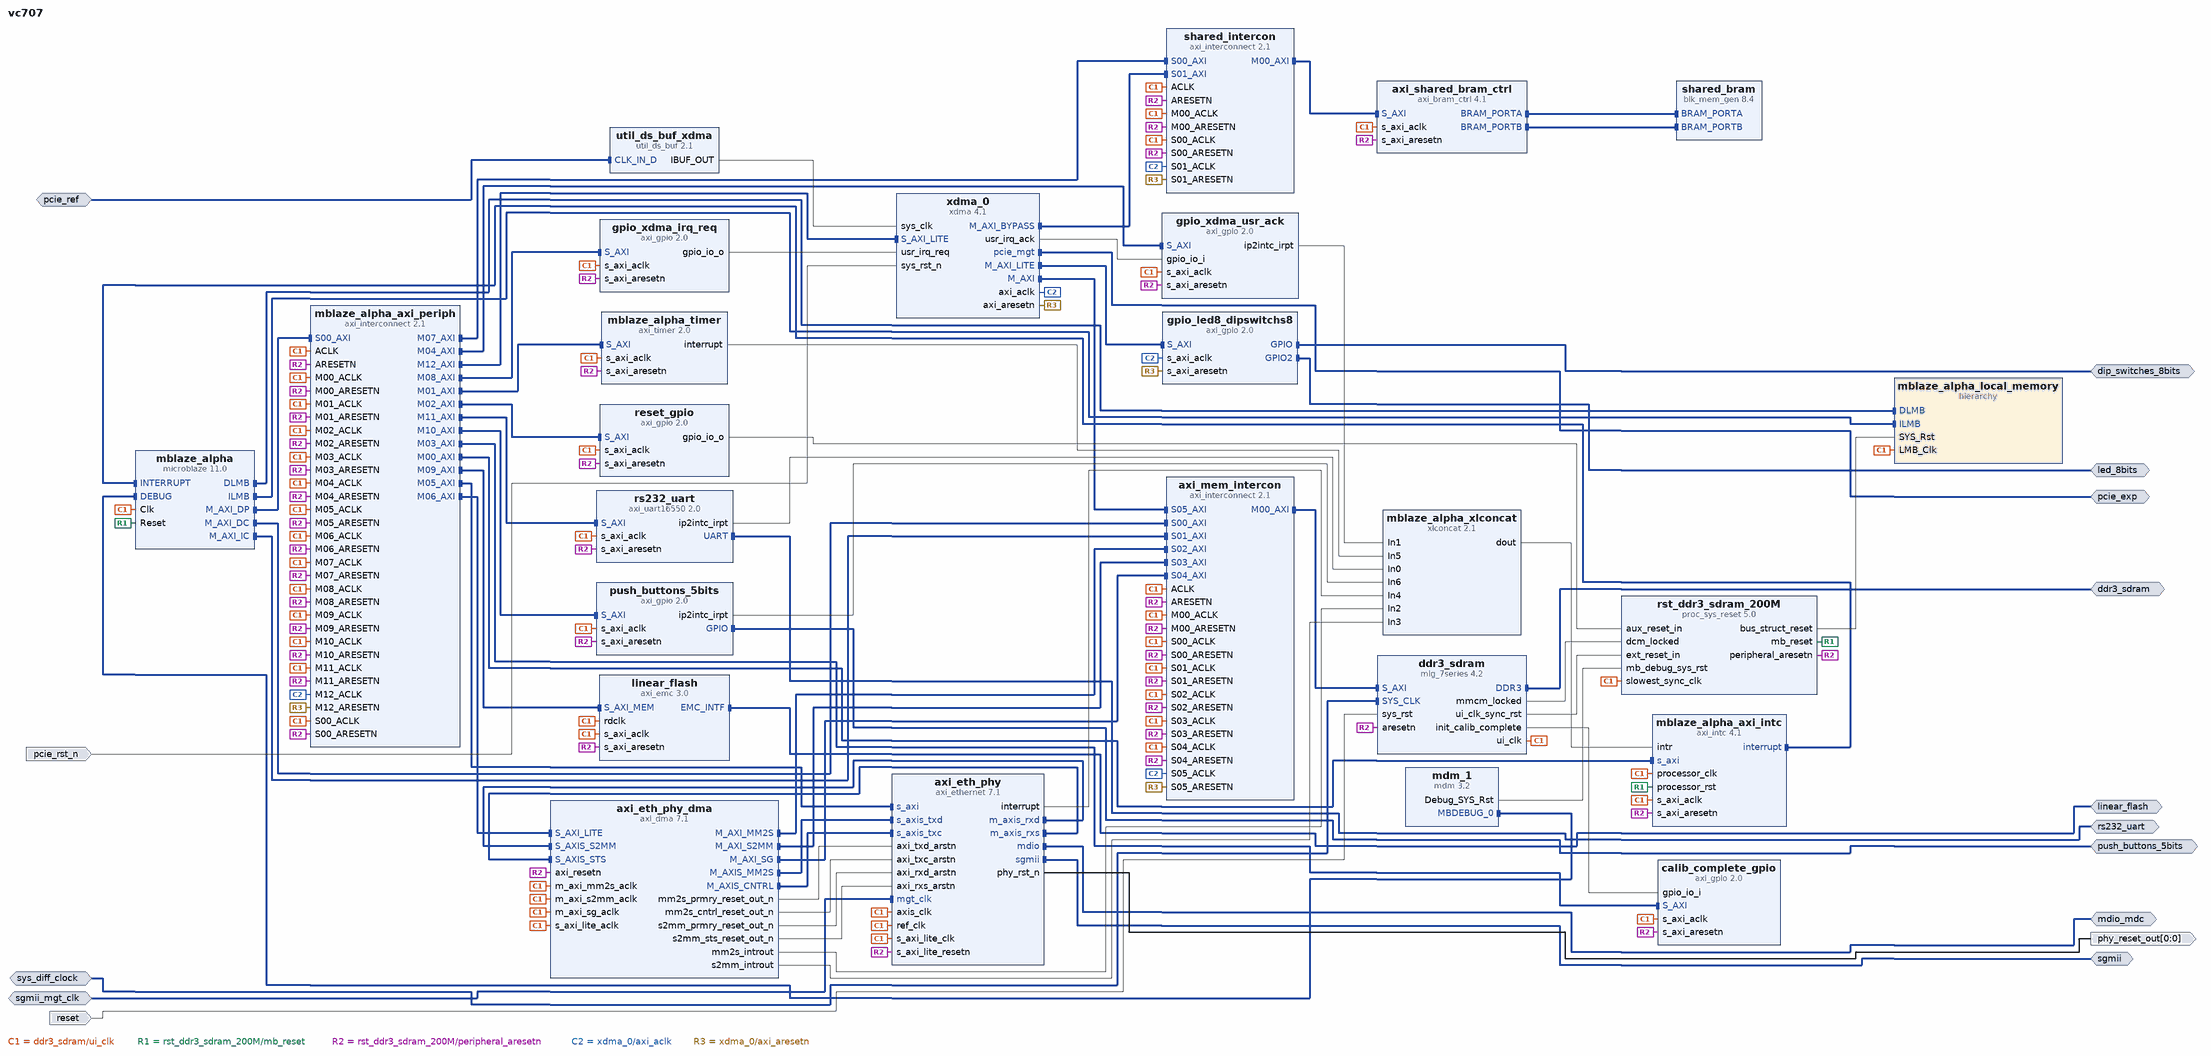
[diagram p0: block diagram of the top level]
# Vivado block design vc707, xc7vx485tffg1761-2, Vivado 2019.2
create_bd_design vc707

create_bd_intf_port -mode Master -vlnv xilinx.com:interface:gpio_rtl:1.0 push_buttons_5bits
create_bd_intf_port -mode Master -vlnv xilinx.com:interface:emc_rtl:1.0 linear_flash
create_bd_intf_port -mode Master -vlnv xilinx.com:interface:gpio_rtl:1.0 dip_switches_8bits
create_bd_intf_port -mode Master -vlnv xilinx.com:interface:ddrx_rtl:1.0 ddr3_sdram
create_bd_intf_port -mode Master -vlnv xilinx.com:interface:uart_rtl:1.0 rs232_uart
create_bd_intf_port -mode Master -vlnv xilinx.com:interface:pcie_7x_mgt_rtl:1.0 pcie_exp
create_bd_intf_port -mode Master -vlnv xilinx.com:interface:gpio_rtl:1.0 led_8bits
create_bd_intf_port -mode Slave -vlnv xilinx.com:interface:diff_clock_rtl:1.0 pcie_ref
create_bd_intf_port -mode Slave -vlnv xilinx.com:interface:diff_clock_rtl:1.0 sys_diff_clock
set_property -dict {CONFIG.FREQ_HZ 200000000} [get_bd_intf_ports sys_diff_clock]
create_bd_intf_port -mode Master -vlnv xilinx.com:interface:sgmii_rtl:1.0 sgmii
create_bd_intf_port -mode Master -vlnv xilinx.com:interface:mdio_rtl:1.0 mdio_mdc
create_bd_intf_port -mode Slave -vlnv xilinx.com:interface:diff_clock_rtl:1.0 sgmii_mgt_clk
set_property -dict {CONFIG.FREQ_HZ 125000000} [get_bd_intf_ports sgmii_mgt_clk]
create_bd_port -dir I -type rst reset
set_property -dict {CONFIG.POLARITY ACTIVE_HIGH} [get_bd_ports reset]
create_bd_port -dir I -type rst pcie_rst_n
create_bd_port -dir O -from 0 -to 0 -type rst phy_reset_out

create_bd_cell -type hier mblaze_alpha_local_memory
create_bd_cell -type ip -vlnv xilinx.com:ip:axi_interconnect:2.1 axi_mem_intercon
set_property -dict {CONFIG.NUM_MI 1 CONFIG.NUM_SI 6} [get_bd_cells axi_mem_intercon]
create_bd_cell -type ip -vlnv xilinx.com:ip:axi_timer:2.0 mblaze_alpha_timer
set_property -dict {CONFIG.enable_timer2 1} [get_bd_cells mblaze_alpha_timer]
create_bd_cell -type ip -vlnv xilinx.com:ip:axi_gpio:2.0 calib_complete_gpio
set_property -dict {CONFIG.C_ALL_INPUTS 1 CONFIG.C_GPIO_WIDTH 1 CONFIG.C_IS_DUAL 0} [get_bd_cells calib_complete_gpio]
create_bd_cell -type ip -vlnv xilinx.com:ip:mig_7series:4.2 ddr3_sdram
set_property -dict [list \
  CONFIG.BOARD_MIG_PARAM ddr3_sdram \
  CONFIG.RESET_BOARD_INTERFACE reset \
  CONFIG.XML_INPUT_FILE board.prj \
] [get_bd_cells ddr3_sdram]
create_bd_cell -type ip -vlnv xilinx.com:ip:axi_gpio:2.0 gpio_led8_dipswitchs8
set_property -dict [list \
  CONFIG.GPIO2_BOARD_INTERFACE led_8bits \
  CONFIG.GPIO_BOARD_INTERFACE dip_switches_8bits \
  CONFIG.USE_BOARD_FLOW true \
] [get_bd_cells gpio_led8_dipswitchs8]
create_bd_cell -type ip -vlnv xilinx.com:ip:axi_emc:3.0 linear_flash
set_property -dict [list \
  CONFIG.C_INCLUDE_DATAWIDTH_MATCHING_0 1 \
  CONFIG.C_MEM0_TYPE 2 \
  CONFIG.C_MEM0_WIDTH 16 \
  CONFIG.C_TAVDV_PS_MEM_0 96000 \
  CONFIG.C_TCEDV_PS_MEM_0 96000 \
  CONFIG.C_THZCE_PS_MEM_0 9000 \
  CONFIG.C_TLZWE_PS_MEM_0 20000 \
  CONFIG.C_TWC_PS_MEM_0 40000 \
  CONFIG.C_TWPH_PS_MEM_0 20000 \
  CONFIG.C_TWP_PS_MEM_0 40000 \
  CONFIG.C_WR_REC_TIME_MEM_0 200000 \
  CONFIG.EMC_BOARD_INTERFACE linear_flash \
  CONFIG.USE_BOARD_FLOW true \
] [get_bd_cells linear_flash]
create_bd_cell -type ip -vlnv xilinx.com:ip:mdm:3.2 mdm_1
create_bd_cell -type ip -vlnv xilinx.com:ip:microblaze:11.0 mblaze_alpha
set_property -dict [list \
  CONFIG.C_ADDR_TAG_BITS 16 \
  CONFIG.C_CACHE_BYTE_SIZE 16384 \
  CONFIG.C_DCACHE_ADDR_TAG 16 \
  CONFIG.C_DCACHE_BYTE_SIZE 16384 \
  CONFIG.C_DCACHE_LINE_LEN 8 \
  CONFIG.C_DCACHE_USE_WRITEBACK 0 \
  CONFIG.C_DEBUG_ENABLED 1 \
  CONFIG.C_DIV_ZERO_EXCEPTION 1 \
  CONFIG.C_D_AXI 1 \
  CONFIG.C_D_LMB 1 \
  CONFIG.C_ICACHE_FORCE_TAG_LUTRAM 1 \
  CONFIG.C_ICACHE_LINE_LEN 8 \
  CONFIG.C_ICACHE_STREAMS 1 \
  CONFIG.C_ICACHE_VICTIMS 8 \
  CONFIG.C_ILL_OPCODE_EXCEPTION 1 \
  CONFIG.C_I_LMB 1 \
  CONFIG.C_MMU_ZONES 2 \
  CONFIG.C_M_AXI_D_BUS_EXCEPTION 1 \
  CONFIG.C_M_AXI_I_BUS_EXCEPTION 1 \
  CONFIG.C_OPCODE_0x0_ILLEGAL 1 \
  CONFIG.C_PVR 2 \
  CONFIG.C_UNALIGNED_EXCEPTIONS 1 \
  CONFIG.C_USE_BARREL 1 \
  CONFIG.C_USE_BRANCH_TARGET_CACHE 0 \
  CONFIG.C_USE_DCACHE 1 \
  CONFIG.C_USE_DIV 1 \
  CONFIG.C_USE_FPU 0 \
  CONFIG.C_USE_HW_MUL 2 \
  CONFIG.C_USE_ICACHE 1 \
  CONFIG.C_USE_MMU 3 \
  CONFIG.C_USE_MSR_INSTR 1 \
  CONFIG.C_USE_PCMP_INSTR 1 \
  CONFIG.G_TEMPLATE_LIST 4 \
  CONFIG.G_USE_EXCEPTIONS 1 \
] [get_bd_cells mblaze_alpha]
create_bd_cell -type ip -vlnv xilinx.com:ip:axi_intc:4.1 mblaze_alpha_axi_intc
set_property -dict {CONFIG.C_HAS_FAST 1} [get_bd_cells mblaze_alpha_axi_intc]
create_bd_cell -type ip -vlnv xilinx.com:ip:axi_interconnect:2.1 mblaze_alpha_axi_periph
set_property -dict {CONFIG.NUM_MI 13 CONFIG.NUM_SI 1} [get_bd_cells mblaze_alpha_axi_periph]
create_bd_cell -type ip -vlnv xilinx.com:ip:xlconcat:2.1 mblaze_alpha_xlconcat
set_property -dict {CONFIG.NUM_PORTS 7 CONFIG.dout_width 7} [get_bd_cells mblaze_alpha_xlconcat]
create_bd_cell -type ip -vlnv xilinx.com:ip:axi_gpio:2.0 push_buttons_5bits
set_property -dict [list \
  CONFIG.C_INTERRUPT_PRESENT 1 \
  CONFIG.GPIO_BOARD_INTERFACE push_buttons_5bits \
  CONFIG.USE_BOARD_FLOW true \
] [get_bd_cells push_buttons_5bits]
create_bd_cell -type ip -vlnv xilinx.com:ip:axi_gpio:2.0 reset_gpio
set_property -dict {CONFIG.C_ALL_OUTPUTS 1 CONFIG.C_GPIO_WIDTH 1} [get_bd_cells reset_gpio]
create_bd_cell -type ip -vlnv xilinx.com:ip:axi_uart16550:2.0 rs232_uart
set_property -dict [list \
  CONFIG.C_S_AXI_ACLK_FREQ_HZ 200000000 \
  CONFIG.UART_BOARD_INTERFACE rs232_uart \
  CONFIG.USE_BOARD_FLOW true \
] [get_bd_cells rs232_uart]
create_bd_cell -type ip -vlnv xilinx.com:ip:proc_sys_reset:5.0 rst_ddr3_sdram_200M
set_property -dict {CONFIG.C_AUX_RESET_HIGH 1 CONFIG.C_AUX_RST_WIDTH 1} [get_bd_cells rst_ddr3_sdram_200M]
create_bd_cell -type ip -vlnv xilinx.com:ip:xdma:4.1 xdma_0
set_property -dict [list \
  CONFIG.PF0_DEVICE_ID_mqdma 9028 \
  CONFIG.PF2_DEVICE_ID_mqdma 9028 \
  CONFIG.PF3_DEVICE_ID_mqdma 9028 \
  CONFIG.axi_data_width 128_bit \
  CONFIG.axilite_master_en true \
  CONFIG.axilite_master_scale Kilobytes \
  CONFIG.axilite_master_size 128 \
  CONFIG.axist_bypass_en true \
  CONFIG.axist_bypass_scale Kilobytes \
  CONFIG.axist_bypass_size 64 \
  CONFIG.axisten_freq 250 \
  CONFIG.cfg_mgmt_if false \
  CONFIG.pcie_blk_locn X1Y1 \
  CONFIG.pf0_device_id 7029 \
  CONFIG.pf0_interrupt_pin INTA \
  CONFIG.pf0_msi_cap_multimsgcap 1_vector \
  CONFIG.pf0_msi_enabled true \
  CONFIG.pf0_msix_enabled false \
  CONFIG.pl_link_cap_max_link_speed 5.0_GT/s \
  CONFIG.pl_link_cap_max_link_width X8 \
  CONFIG.plltype QPLL1 \
  CONFIG.xdma_axilite_slave true \
  CONFIG.xdma_num_usr_irq 1 \
] [get_bd_cells xdma_0]
create_bd_cell -type ip -vlnv xilinx.com:ip:util_ds_buf:2.1 util_ds_buf_xdma
set_property -dict {CONFIG.C_BUF_TYPE IBUFDSGTE} [get_bd_cells util_ds_buf_xdma]
create_bd_cell -type ip -vlnv xilinx.com:ip:axi_gpio:2.0 gpio_xdma_irq_req
set_property -dict {CONFIG.C_ALL_OUTPUTS 1 CONFIG.C_GPIO_WIDTH 1} [get_bd_cells gpio_xdma_irq_req]
create_bd_cell -type ip -vlnv xilinx.com:ip:axi_gpio:2.0 gpio_xdma_usr_ack
set_property -dict {CONFIG.C_ALL_INPUTS 1 CONFIG.C_GPIO_WIDTH 1 CONFIG.C_INTERRUPT_PRESENT 1} [get_bd_cells gpio_xdma_usr_ack]
create_bd_cell -type ip -vlnv xilinx.com:ip:axi_interconnect:2.1 shared_intercon
set_property -dict {CONFIG.NUM_MI 1 CONFIG.NUM_SI 2} [get_bd_cells shared_intercon]
create_bd_cell -type ip -vlnv xilinx.com:ip:axi_bram_ctrl:4.1 axi_shared_bram_ctrl
create_bd_cell -type ip -vlnv xilinx.com:ip:blk_mem_gen:8.4 shared_bram
set_property -dict {CONFIG.Memory_Type True_Dual_Port_RAM} [get_bd_cells shared_bram]
create_bd_cell -type ip -vlnv xilinx.com:ip:axi_ethernet:7.1 axi_eth_phy
set_property -dict [list \
  CONFIG.DIFFCLK_BOARD_INTERFACE sgmii_mgt_clk \
  CONFIG.ETHERNET_BOARD_INTERFACE sgmii \
  CONFIG.MDIO_BOARD_INTERFACE mdio_mdc \
  CONFIG.PHYRST_BOARD_INTERFACE phy_reset_out \
] [get_bd_cells axi_eth_phy]
create_bd_cell -type ip -vlnv xilinx.com:ip:axi_dma:7.1 axi_eth_phy_dma
set_property -dict [list \
  CONFIG.c_include_mm2s_dre 1 \
  CONFIG.c_include_s2mm_dre 1 \
  CONFIG.c_sg_length_width 16 \
  CONFIG.c_sg_use_stsapp_length 1 \
] [get_bd_cells axi_eth_phy_dma]

# ---- hierarchy /mblaze_alpha_local_memory ----
current_bd_instance /mblaze_alpha_local_memory
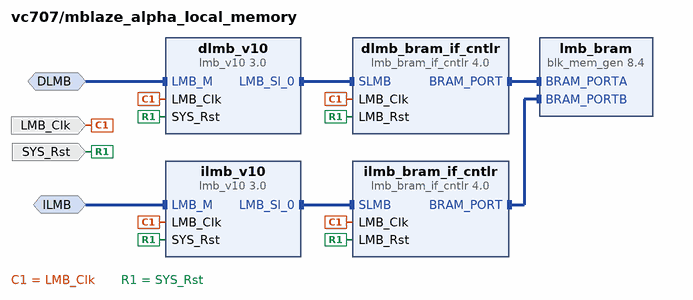
[diagram p1: block diagram inside /mblaze_alpha_local_memory]
create_bd_intf_pin -mode MirroredMaster -vlnv xilinx.com:interface:lmb_rtl:1.0 DLMB
create_bd_intf_pin -mode MirroredMaster -vlnv xilinx.com:interface:lmb_rtl:1.0 ILMB
create_bd_pin -dir I -type clk LMB_Clk
create_bd_pin -dir I -type rst SYS_Rst

create_bd_cell -type ip -vlnv xilinx.com:ip:lmb_bram_if_cntlr:4.0 dlmb_bram_if_cntlr
set_property -dict {CONFIG.C_ECC 0} [get_bd_cells dlmb_bram_if_cntlr]
create_bd_cell -type ip -vlnv xilinx.com:ip:lmb_v10:3.0 dlmb_v10
create_bd_cell -type ip -vlnv xilinx.com:ip:lmb_bram_if_cntlr:4.0 ilmb_bram_if_cntlr
set_property -dict {CONFIG.C_ECC 0} [get_bd_cells ilmb_bram_if_cntlr]
create_bd_cell -type ip -vlnv xilinx.com:ip:lmb_v10:3.0 ilmb_v10
create_bd_cell -type ip -vlnv xilinx.com:ip:blk_mem_gen:8.4 lmb_bram
set_property -dict [list \
  CONFIG.Enable_B Use_ENB_Pin \
  CONFIG.Memory_Type True_Dual_Port_RAM \
  CONFIG.Port_B_Clock 100 \
  CONFIG.Port_B_Enable_Rate 100 \
  CONFIG.Port_B_Write_Rate 50 \
  CONFIG.Use_RSTB_Pin true \
  CONFIG.use_bram_block BRAM_Controller \
] [get_bd_cells lmb_bram]

# ---- connections ----

current_bd_instance /mblaze_alpha_local_memory
connect_bd_intf_net -intf_net microblaze_0_ilmb_bus [get_bd_intf_pins ilmb_v10/LMB_Sl_0] [get_bd_intf_pins ilmb_bram_if_cntlr/SLMB]
connect_bd_intf_net -intf_net microblaze_0_dlmb_cntlr [get_bd_intf_pins dlmb_bram_if_cntlr/BRAM_PORT] [get_bd_intf_pins lmb_bram/BRAM_PORTA]
connect_bd_intf_net -intf_net microblaze_0_dlmb [get_bd_intf_pins DLMB] [get_bd_intf_pins dlmb_v10/LMB_M]
connect_bd_intf_net -intf_net microblaze_0_ilmb_cntlr [get_bd_intf_pins ilmb_bram_if_cntlr/BRAM_PORT] [get_bd_intf_pins lmb_bram/BRAM_PORTB]
connect_bd_intf_net -intf_net microblaze_0_ilmb [get_bd_intf_pins ILMB] [get_bd_intf_pins ilmb_v10/LMB_M]
connect_bd_intf_net -intf_net microblaze_0_dlmb_bus [get_bd_intf_pins dlmb_v10/LMB_Sl_0] [get_bd_intf_pins dlmb_bram_if_cntlr/SLMB]
connect_bd_net -net microblaze_0_Clk [get_bd_pins LMB_Clk] \
  [get_bd_pins dlmb_bram_if_cntlr/LMB_Clk] [get_bd_pins dlmb_v10/LMB_Clk] [get_bd_pins ilmb_bram_if_cntlr/LMB_Clk] \
  [get_bd_pins ilmb_v10/LMB_Clk]
connect_bd_net [get_bd_pins SYS_Rst] \
  [get_bd_pins dlmb_bram_if_cntlr/LMB_Rst] [get_bd_pins dlmb_v10/SYS_Rst] [get_bd_pins ilmb_bram_if_cntlr/LMB_Rst] \
  [get_bd_pins ilmb_v10/SYS_Rst]
set_property HDL_ATTRIBUTE.BMM_INFO_ADDRESS_SPACE {byte  0x40000000 32 > vc707 mblaze_alpha_local_memory/lmb_bram} [get_bd_cells dlmb_bram_if_cntlr]
set_property HDL_ATTRIBUTE.KEEP_HIERARCHY yes [get_bd_cells dlmb_bram_if_cntlr]

current_bd_instance /
connect_bd_intf_net [get_bd_intf_pins shared_intercon/M00_AXI] [get_bd_intf_pins axi_shared_bram_ctrl/S_AXI]
connect_bd_intf_net [get_bd_intf_ports sys_diff_clock] [get_bd_intf_pins ddr3_sdram/SYS_CLK]
connect_bd_intf_net [get_bd_intf_pins mblaze_alpha_axi_periph/M04_AXI] [get_bd_intf_pins gpio_xdma_usr_ack/S_AXI]
connect_bd_intf_net [get_bd_intf_ports rs232_uart] [get_bd_intf_pins rs232_uart/UART]
connect_bd_intf_net [get_bd_intf_ports ddr3_sdram] [get_bd_intf_pins ddr3_sdram/DDR3]
connect_bd_intf_net -intf_net microblaze_0_dlmb_1 [get_bd_intf_pins mblaze_alpha/DLMB] [get_bd_intf_pins mblaze_alpha_local_memory/DLMB]
connect_bd_intf_net [get_bd_intf_pins mblaze_alpha_axi_periph/M03_AXI] [get_bd_intf_pins calib_complete_gpio/S_AXI]
connect_bd_intf_net -intf_net microblaze_0_ilmb_1 [get_bd_intf_pins mblaze_alpha/ILMB] [get_bd_intf_pins mblaze_alpha_local_memory/ILMB]
connect_bd_intf_net [get_bd_intf_pins xdma_0/M_AXI_BYPASS] [get_bd_intf_pins shared_intercon/S01_AXI]
connect_bd_intf_net -intf_net microblaze_0_interrupt [get_bd_intf_pins mblaze_alpha_axi_intc/interrupt] [get_bd_intf_pins mblaze_alpha/INTERRUPT]
connect_bd_intf_net [get_bd_intf_pins mblaze_alpha_axi_periph/M12_AXI] [get_bd_intf_pins xdma_0/S_AXI_LITE]
connect_bd_intf_net [get_bd_intf_ports linear_flash] [get_bd_intf_pins linear_flash/EMC_INTF]
connect_bd_intf_net [get_bd_intf_pins mblaze_alpha_axi_periph/M09_AXI] [get_bd_intf_pins linear_flash/S_AXI_MEM]
connect_bd_intf_net -intf_net dip_switches_4bits_GPIO [get_bd_intf_ports dip_switches_8bits] [get_bd_intf_pins gpio_led8_dipswitchs8/GPIO]
connect_bd_intf_net -intf_net microblaze_0_M_AXI_DC [get_bd_intf_pins mblaze_alpha/M_AXI_DC] [get_bd_intf_pins axi_mem_intercon/S00_AXI]
connect_bd_intf_net -intf_net microblaze_0_intc_axi [get_bd_intf_pins mblaze_alpha_axi_periph/M00_AXI] [get_bd_intf_pins mblaze_alpha_axi_intc/s_axi]
connect_bd_intf_net [get_bd_intf_pins mblaze_alpha_axi_periph/M02_AXI] [get_bd_intf_pins reset_gpio/S_AXI]
connect_bd_intf_net -intf_net CLK_IN_D_0_1 [get_bd_intf_ports pcie_ref] [get_bd_intf_pins util_ds_buf_xdma/CLK_IN_D]
connect_bd_intf_net [get_bd_intf_pins shared_bram/BRAM_PORTA] [get_bd_intf_pins axi_shared_bram_ctrl/BRAM_PORTA]
connect_bd_intf_net [get_bd_intf_pins shared_bram/BRAM_PORTB] [get_bd_intf_pins axi_shared_bram_ctrl/BRAM_PORTB]
connect_bd_intf_net [get_bd_intf_ports push_buttons_5bits] [get_bd_intf_pins push_buttons_5bits/GPIO]
connect_bd_intf_net -intf_net microblaze_0_debug [get_bd_intf_pins mdm_1/MBDEBUG_0] [get_bd_intf_pins mblaze_alpha/DEBUG]
connect_bd_intf_net [get_bd_intf_pins mblaze_alpha_axi_periph/M10_AXI] [get_bd_intf_pins push_buttons_5bits/S_AXI]
connect_bd_intf_net -intf_net dip_switches_8bits_GPIO2 [get_bd_intf_ports led_8bits] [get_bd_intf_pins gpio_led8_dipswitchs8/GPIO2]
connect_bd_intf_net [get_bd_intf_ports pcie_exp] [get_bd_intf_pins xdma_0/pcie_mgt]
connect_bd_intf_net -intf_net microblaze_0_axi_dp [get_bd_intf_pins mblaze_alpha_axi_periph/S00_AXI] [get_bd_intf_pins mblaze_alpha/M_AXI_DP]
connect_bd_intf_net [get_bd_intf_pins axi_mem_intercon/M00_AXI] [get_bd_intf_pins ddr3_sdram/S_AXI]
connect_bd_intf_net [get_bd_intf_pins mblaze_alpha_axi_periph/M11_AXI] [get_bd_intf_pins rs232_uart/S_AXI]
connect_bd_intf_net -intf_net microblaze_0_M_AXI_IC [get_bd_intf_pins mblaze_alpha/M_AXI_IC] [get_bd_intf_pins axi_mem_intercon/S01_AXI]
connect_bd_intf_net [get_bd_intf_pins xdma_0/M_AXI] [get_bd_intf_pins axi_mem_intercon/S05_AXI]
connect_bd_intf_net [get_bd_intf_pins mblaze_alpha_axi_periph/M01_AXI] [get_bd_intf_pins mblaze_alpha_timer/S_AXI]
connect_bd_intf_net [get_bd_intf_pins mblaze_alpha_axi_periph/M07_AXI] [get_bd_intf_pins shared_intercon/S00_AXI]
connect_bd_intf_net [get_bd_intf_pins mblaze_alpha_axi_periph/M08_AXI] [get_bd_intf_pins gpio_xdma_irq_req/S_AXI]
connect_bd_intf_net [get_bd_intf_pins xdma_0/M_AXI_LITE] [get_bd_intf_pins gpio_led8_dipswitchs8/S_AXI]
connect_bd_intf_net [get_bd_intf_ports sgmii_mgt_clk] [get_bd_intf_pins axi_eth_phy/mgt_clk]
connect_bd_intf_net [get_bd_intf_pins axi_eth_phy_dma/M_AXIS_MM2S] [get_bd_intf_pins axi_eth_phy/s_axis_txd]
connect_bd_intf_net [get_bd_intf_pins mblaze_alpha_axi_periph/M06_AXI] [get_bd_intf_pins axi_eth_phy_dma/S_AXI_LITE]
connect_bd_intf_net [get_bd_intf_pins axi_eth_phy_dma/S_AXIS_S2MM] [get_bd_intf_pins axi_eth_phy/m_axis_rxd]
connect_bd_intf_net [get_bd_intf_pins axi_eth_phy_dma/M_AXIS_CNTRL] [get_bd_intf_pins axi_eth_phy/s_axis_txc]
connect_bd_intf_net [get_bd_intf_pins axi_eth_phy_dma/S_AXIS_STS] [get_bd_intf_pins axi_eth_phy/m_axis_rxs]
connect_bd_intf_net -intf_net axi_ethernet_0_mdio [get_bd_intf_ports mdio_mdc] [get_bd_intf_pins axi_eth_phy/mdio]
connect_bd_intf_net -intf_net axi_ethernet_0_sgmii [get_bd_intf_ports sgmii] [get_bd_intf_pins axi_eth_phy/sgmii]
connect_bd_intf_net [get_bd_intf_pins axi_eth_phy_dma/M_AXI_MM2S] [get_bd_intf_pins axi_mem_intercon/S02_AXI]
connect_bd_intf_net [get_bd_intf_pins axi_eth_phy_dma/M_AXI_S2MM] [get_bd_intf_pins axi_mem_intercon/S03_AXI]
connect_bd_intf_net [get_bd_intf_pins axi_eth_phy_dma/M_AXI_SG] [get_bd_intf_pins axi_mem_intercon/S04_AXI]
connect_bd_intf_net [get_bd_intf_pins mblaze_alpha_axi_periph/M05_AXI] [get_bd_intf_pins axi_eth_phy/s_axi]
connect_bd_net -net microblaze_0_intr [get_bd_pins mblaze_alpha_xlconcat/dout] [get_bd_pins mblaze_alpha_axi_intc/intr]
connect_bd_net -net microblaze_0_Clk [get_bd_pins ddr3_sdram/ui_clk] \
  [get_bd_pins mblaze_alpha_local_memory/LMB_Clk] [get_bd_pins axi_mem_intercon/ACLK] \
  [get_bd_pins mblaze_alpha_timer/s_axi_aclk] [get_bd_pins calib_complete_gpio/s_axi_aclk] \
  [get_bd_pins linear_flash/s_axi_aclk] [get_bd_pins linear_flash/rdclk] [get_bd_pins mblaze_alpha/Clk] \
  [get_bd_pins mblaze_alpha_axi_intc/s_axi_aclk] [get_bd_pins mblaze_alpha_axi_intc/processor_clk] \
  [get_bd_pins mblaze_alpha_axi_periph/ACLK] [get_bd_pins mblaze_alpha_axi_periph/S00_ACLK] \
  [get_bd_pins mblaze_alpha_axi_periph/M00_ACLK] [get_bd_pins mblaze_alpha_axi_periph/M01_ACLK] \
  [get_bd_pins mblaze_alpha_axi_periph/M02_ACLK] [get_bd_pins mblaze_alpha_axi_periph/M03_ACLK] \
  [get_bd_pins mblaze_alpha_axi_periph/M04_ACLK] [get_bd_pins mblaze_alpha_axi_periph/M05_ACLK] \
  [get_bd_pins mblaze_alpha_axi_periph/M06_ACLK] [get_bd_pins mblaze_alpha_axi_periph/M07_ACLK] \
  [get_bd_pins mblaze_alpha_axi_periph/M09_ACLK] [get_bd_pins mblaze_alpha_axi_periph/M10_ACLK] \
  [get_bd_pins mblaze_alpha_axi_periph/M11_ACLK] [get_bd_pins push_buttons_5bits/s_axi_aclk] \
  [get_bd_pins reset_gpio/s_axi_aclk] [get_bd_pins rs232_uart/s_axi_aclk] [get_bd_pins rst_ddr3_sdram_200M/slowest_sync_clk] \
  [get_bd_pins gpio_xdma_irq_req/s_axi_aclk] [get_bd_pins axi_mem_intercon/M00_ACLK] [get_bd_pins axi_mem_intercon/S00_ACLK] \
  [get_bd_pins axi_mem_intercon/S01_ACLK] [get_bd_pins axi_mem_intercon/S02_ACLK] [get_bd_pins axi_mem_intercon/S03_ACLK] \
  [get_bd_pins axi_mem_intercon/S04_ACLK] [get_bd_pins gpio_xdma_usr_ack/s_axi_aclk] [get_bd_pins shared_intercon/M00_ACLK] \
  [get_bd_pins shared_intercon/ACLK] [get_bd_pins shared_intercon/S00_ACLK] [get_bd_pins mblaze_alpha_axi_periph/M08_ACLK] \
  [get_bd_pins axi_shared_bram_ctrl/s_axi_aclk] [get_bd_pins axi_eth_phy/ref_clk] \
  [get_bd_pins axi_eth_phy_dma/m_axi_mm2s_aclk] [get_bd_pins axi_eth_phy_dma/m_axi_s2mm_aclk] \
  [get_bd_pins axi_eth_phy/axis_clk] [get_bd_pins axi_eth_phy/s_axi_lite_clk] [get_bd_pins axi_eth_phy_dma/m_axi_sg_aclk] \
  [get_bd_pins axi_eth_phy_dma/s_axi_lite_aclk]
connect_bd_net [get_bd_pins ddr3_sdram/mmcm_locked] [get_bd_pins rst_ddr3_sdram_200M/dcm_locked]
connect_bd_net [get_bd_pins ddr3_sdram/ui_clk_sync_rst] [get_bd_pins rst_ddr3_sdram_200M/ext_reset_in]
connect_bd_net [get_bd_pins rst_ddr3_sdram_200M/mb_reset] [get_bd_pins mblaze_alpha/Reset] [get_bd_pins mblaze_alpha_axi_intc/processor_rst]
connect_bd_net [get_bd_pins rst_ddr3_sdram_200M/bus_struct_reset] [get_bd_pins mblaze_alpha_local_memory/SYS_Rst]
connect_bd_net [get_bd_pins rst_ddr3_sdram_200M/peripheral_aresetn] \
  [get_bd_pins axi_mem_intercon/ARESETN] [get_bd_pins mblaze_alpha_timer/s_axi_aresetn] \
  [get_bd_pins calib_complete_gpio/s_axi_aresetn] [get_bd_pins ddr3_sdram/aresetn] [get_bd_pins linear_flash/s_axi_aresetn] \
  [get_bd_pins mblaze_alpha_axi_intc/s_axi_aresetn] [get_bd_pins mblaze_alpha_axi_periph/ARESETN] \
  [get_bd_pins mblaze_alpha_axi_periph/S00_ARESETN] [get_bd_pins mblaze_alpha_axi_periph/M00_ARESETN] \
  [get_bd_pins mblaze_alpha_axi_periph/M01_ARESETN] [get_bd_pins mblaze_alpha_axi_periph/M02_ARESETN] \
  [get_bd_pins mblaze_alpha_axi_periph/M03_ARESETN] [get_bd_pins mblaze_alpha_axi_periph/M04_ARESETN] \
  [get_bd_pins mblaze_alpha_axi_periph/M05_ARESETN] [get_bd_pins mblaze_alpha_axi_periph/M06_ARESETN] \
  [get_bd_pins mblaze_alpha_axi_periph/M07_ARESETN] [get_bd_pins mblaze_alpha_axi_periph/M09_ARESETN] \
  [get_bd_pins mblaze_alpha_axi_periph/M10_ARESETN] [get_bd_pins mblaze_alpha_axi_periph/M11_ARESETN] \
  [get_bd_pins push_buttons_5bits/s_axi_aresetn] [get_bd_pins reset_gpio/s_axi_aresetn] \
  [get_bd_pins rs232_uart/s_axi_aresetn] [get_bd_pins gpio_xdma_irq_req/s_axi_aresetn] \
  [get_bd_pins axi_mem_intercon/M00_ARESETN] [get_bd_pins axi_mem_intercon/S00_ARESETN] \
  [get_bd_pins axi_mem_intercon/S01_ARESETN] [get_bd_pins axi_mem_intercon/S02_ARESETN] \
  [get_bd_pins axi_mem_intercon/S03_ARESETN] [get_bd_pins axi_mem_intercon/S04_ARESETN] \
  [get_bd_pins gpio_xdma_usr_ack/s_axi_aresetn] [get_bd_pins shared_intercon/M00_ARESETN] \
  [get_bd_pins shared_intercon/ARESETN] [get_bd_pins shared_intercon/S00_ARESETN] \
  [get_bd_pins mblaze_alpha_axi_periph/M08_ARESETN] [get_bd_pins axi_shared_bram_ctrl/s_axi_aresetn] \
  [get_bd_pins axi_eth_phy/s_axi_lite_resetn] [get_bd_pins axi_eth_phy_dma/axi_resetn]
connect_bd_net [get_bd_pins mdm_1/Debug_SYS_Rst] [get_bd_pins rst_ddr3_sdram_200M/mb_debug_sys_rst]
connect_bd_net [get_bd_pins reset_gpio/gpio_io_o] [get_bd_pins rst_ddr3_sdram_200M/aux_reset_in]
connect_bd_net [get_bd_pins ddr3_sdram/init_calib_complete] [get_bd_pins calib_complete_gpio/gpio_io_i]
connect_bd_net [get_bd_ports reset] [get_bd_pins ddr3_sdram/sys_rst]
connect_bd_net -net axi_timer_0_interrupt [get_bd_pins mblaze_alpha_timer/interrupt] [get_bd_pins mblaze_alpha_xlconcat/In5]
connect_bd_net [get_bd_pins rs232_uart/ip2intc_irpt] [get_bd_pins mblaze_alpha_xlconcat/In0]
connect_bd_net [get_bd_pins xdma_0/axi_aclk] \
  [get_bd_pins mblaze_alpha_axi_periph/M12_ACLK] [get_bd_pins gpio_led8_dipswitchs8/s_axi_aclk] \
  [get_bd_pins axi_mem_intercon/S05_ACLK] [get_bd_pins shared_intercon/S01_ACLK]
connect_bd_net [get_bd_pins xdma_0/axi_aresetn] \
  [get_bd_pins mblaze_alpha_axi_periph/M12_ARESETN] [get_bd_pins gpio_led8_dipswitchs8/s_axi_aresetn] \
  [get_bd_pins axi_mem_intercon/S05_ARESETN] [get_bd_pins shared_intercon/S01_ARESETN]
connect_bd_net -net sys_rst_n_0_1 [get_bd_ports pcie_rst_n] [get_bd_pins xdma_0/sys_rst_n]
connect_bd_net -net util_ds_buf_0_IBUF_OUT [get_bd_pins util_ds_buf_xdma/IBUF_OUT] [get_bd_pins xdma_0/sys_clk]
connect_bd_net -net axi_gpio_0_gpio_io_o [get_bd_pins gpio_xdma_irq_req/gpio_io_o] [get_bd_pins xdma_0/usr_irq_req]
connect_bd_net [get_bd_pins xdma_0/usr_irq_ack] [get_bd_pins gpio_xdma_usr_ack/gpio_io_i]
connect_bd_net [get_bd_pins push_buttons_5bits/ip2intc_irpt] [get_bd_pins mblaze_alpha_xlconcat/In6]
connect_bd_net -net axi_gpio_0_ip2intc_irpt [get_bd_pins gpio_xdma_usr_ack/ip2intc_irpt] [get_bd_pins mblaze_alpha_xlconcat/In1]
connect_bd_net -net axi_ethernet_0_phy_rst_n [get_bd_pins axi_eth_phy/phy_rst_n] [get_bd_ports phy_reset_out]
connect_bd_net [get_bd_pins axi_eth_phy_dma/mm2s_prmry_reset_out_n] [get_bd_pins axi_eth_phy/axi_txd_arstn]
connect_bd_net [get_bd_pins axi_eth_phy_dma/mm2s_cntrl_reset_out_n] [get_bd_pins axi_eth_phy/axi_txc_arstn]
connect_bd_net [get_bd_pins axi_eth_phy_dma/s2mm_prmry_reset_out_n] [get_bd_pins axi_eth_phy/axi_rxd_arstn]
connect_bd_net [get_bd_pins axi_eth_phy_dma/s2mm_sts_reset_out_n] [get_bd_pins axi_eth_phy/axi_rxs_arstn]
connect_bd_net [get_bd_pins axi_eth_phy_dma/mm2s_introut] [get_bd_pins mblaze_alpha_xlconcat/In2]
connect_bd_net [get_bd_pins axi_eth_phy_dma/s2mm_introut] [get_bd_pins mblaze_alpha_xlconcat/In3]
connect_bd_net [get_bd_pins axi_eth_phy/interrupt] [get_bd_pins mblaze_alpha_xlconcat/In4]
set_property HDL_ATTRIBUTE.BMM_INFO_PROCESSOR {microblaze-le > vc707 mblaze_alpha_local_memory/dlmb_bram_if_cntlr vc707 axi_shared_bram_ctrl} [get_bd_cells mblaze_alpha]
set_property HDL_ATTRIBUTE.KEEP_HIERARCHY yes [get_bd_cells mblaze_alpha]
set_property HDL_ATTRIBUTE.BMM_INFO_ADDRESS_SPACE {byte  0xC0000000 32 > vc707 shared_bram} [get_bd_cells axi_shared_bram_ctrl]
set_property HDL_ATTRIBUTE.KEEP_HIERARCHY yes [get_bd_cells axi_shared_bram_ctrl]

# ---- address map ----
assign_bd_address -offset 0x00000000 -range 1G -target_address_space [get_bd_addr_spaces axi_eth_phy_dma/Data_MM2S] [get_bd_addr_segs ddr3_sdram/memmap/memaddr]
assign_bd_address -offset 0x00000000 -range 1G -target_address_space [get_bd_addr_spaces axi_eth_phy_dma/Data_S2MM] [get_bd_addr_segs ddr3_sdram/memmap/memaddr]
assign_bd_address -offset 0x00000000 -range 1G -target_address_space [get_bd_addr_spaces axi_eth_phy_dma/Data_SG] [get_bd_addr_segs ddr3_sdram/memmap/memaddr]
assign_bd_address -offset 0x00000000 -range 1G -target_address_space [get_bd_addr_spaces mblaze_alpha/Data] [get_bd_addr_segs ddr3_sdram/memmap/memaddr]
assign_bd_address -offset 0x40000000 -range 8K -target_address_space [get_bd_addr_spaces mblaze_alpha/Data] [get_bd_addr_segs mblaze_alpha_local_memory/dlmb_bram_if_cntlr/SLMB/Mem]
assign_bd_address -offset 0x40010000 -range 64K -target_address_space [get_bd_addr_spaces mblaze_alpha/Data] [get_bd_addr_segs calib_complete_gpio/S_AXI/Reg]
assign_bd_address -offset 0x40030000 -range 64K -target_address_space [get_bd_addr_spaces mblaze_alpha/Data] [get_bd_addr_segs gpio_xdma_irq_req/S_AXI/Reg]
assign_bd_address -offset 0x40040000 -range 64K -target_address_space [get_bd_addr_spaces mblaze_alpha/Data] [get_bd_addr_segs gpio_xdma_usr_ack/S_AXI/Reg]
assign_bd_address -offset 0x40050000 -range 64K -target_address_space [get_bd_addr_spaces mblaze_alpha/Data] [get_bd_addr_segs push_buttons_5bits/S_AXI/Reg]
assign_bd_address -offset 0x40060000 -range 64K -target_address_space [get_bd_addr_spaces mblaze_alpha/Data] [get_bd_addr_segs reset_gpio/S_AXI/Reg]
assign_bd_address -offset 0x40C00000 -range 256K -target_address_space [get_bd_addr_spaces mblaze_alpha/Data] [get_bd_addr_segs axi_eth_phy/s_axi/Reg0]
assign_bd_address -offset 0x41200000 -range 64K -target_address_space [get_bd_addr_spaces mblaze_alpha/Data] [get_bd_addr_segs mblaze_alpha_axi_intc/S_AXI/Reg]
assign_bd_address -offset 0x41C00000 -range 64K -target_address_space [get_bd_addr_spaces mblaze_alpha/Data] [get_bd_addr_segs mblaze_alpha_timer/S_AXI/Reg]
assign_bd_address -offset 0x41E00000 -range 64K -target_address_space [get_bd_addr_spaces mblaze_alpha/Data] [get_bd_addr_segs axi_eth_phy_dma/S_AXI_LITE/Reg]
assign_bd_address -offset 0x44A00000 -range 64K -target_address_space [get_bd_addr_spaces mblaze_alpha/Data] [get_bd_addr_segs rs232_uart/S_AXI/Reg]
assign_bd_address -offset 0x60000000 -range 128M -target_address_space [get_bd_addr_spaces mblaze_alpha/Data] [get_bd_addr_segs linear_flash/S_AXI_MEM/Mem0]
assign_bd_address -offset 0x76000000 -range 64K -target_address_space [get_bd_addr_spaces mblaze_alpha/Data] [get_bd_addr_segs xdma_0/S_AXI_LITE/CTL0]
assign_bd_address -offset 0xC0000000 -range 8K -target_address_space [get_bd_addr_spaces mblaze_alpha/Data] [get_bd_addr_segs axi_shared_bram_ctrl/S_AXI/Mem0]
assign_bd_address -offset 0x00000000 -range 1G -target_address_space [get_bd_addr_spaces mblaze_alpha/Instruction] [get_bd_addr_segs ddr3_sdram/memmap/memaddr]
assign_bd_address -offset 0x40000000 -range 8K -target_address_space [get_bd_addr_spaces mblaze_alpha/Instruction] [get_bd_addr_segs mblaze_alpha_local_memory/ilmb_bram_if_cntlr/SLMB/Mem]
assign_bd_address -offset 0x0000000000000000 -range 1G -target_address_space [get_bd_addr_spaces xdma_0/M_AXI] [get_bd_addr_segs ddr3_sdram/memmap/memaddr]
assign_bd_address -offset 0x00000000C0000000 -range 8K -target_address_space [get_bd_addr_spaces xdma_0/M_AXI_BYPASS] [get_bd_addr_segs axi_shared_bram_ctrl/S_AXI/Mem0]
assign_bd_address -offset 0x40000000 -range 64K -target_address_space [get_bd_addr_spaces xdma_0/M_AXI_LITE] [get_bd_addr_segs gpio_led8_dipswitchs8/S_AXI/Reg]

validate_bd_design
save_bd_design
